# Altium schematic sheet mcu.SchDoc: Hall / Main Board / MCU and ADCs
size A4; DocumentNumber: 4; SheetNumber: 4; SheetTotal: 7
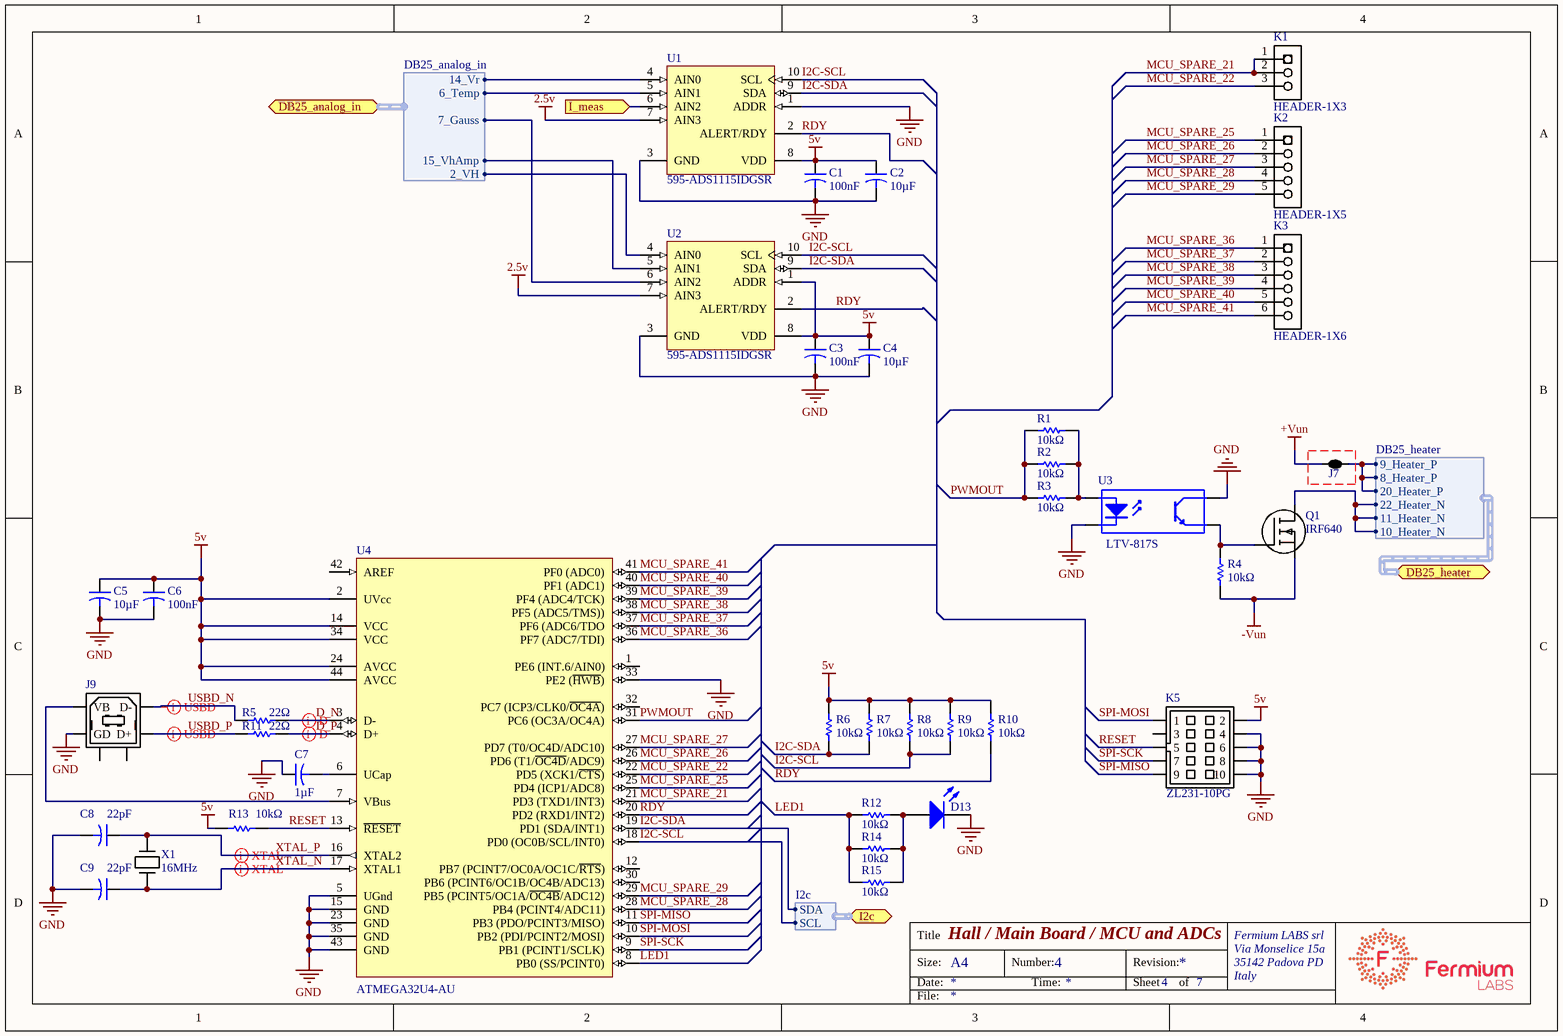
[diagram p0: mcu.SchDoc]

## Parts
C1  Capacitance: 100nF  [CAP 0805/2012]
C2  Capacitance: 10µF  [CAP 1206/3216]
C3  Capacitance: 100nF  [CAP 0805/2012]
C4  Capacitance: 10µF  [CAP 1206/3216]
C5  Capacitance: 10µF  [CAP 1206/3216]
C6  Capacitance: 100nF  [CAP 0805/2012]
C7  Capacitance: 1µF  [CAP 0805/2012]
C8  Capacitance: 22pF  [CAP 0805/2012]
C9  Capacitance: 22pF  [CAP 0805/2012]
D13  (no value)  [LED-0]
J7  2 way net tie junction  [2way_LP]  (value not drawn)  (net tie, no BOM)
J9  (no value)  [USB_TypeB]
K1  HEADER-1X3  [HEADER-1X3]  (no BOM)
K2  HEADER-1X5  [HEADER-1X5]  (no BOM)
K3  HEADER-1X6  [HEADER-1X6]  (no BOM)
K5  Supplier Part Number 1: ZL231-10PG  [IDC10-B]
Q1  IRF640  [DPAK-GDS]
R1  Resistance: 10kΩ  [RES 0805/2012]
R2  Resistance: 10kΩ  [RES 0805/2012]
R3  Resistance: 10kΩ  [RES 0805/2012]
R4  Resistance: 10kΩ  [RES 0805/2012]
R5  Resistance: 22Ω  [RES 0805/2012]
R6  Resistance: 10kΩ  [RES 0805/2012]
R7  Resistance: 10kΩ  [RES 0805/2012]
R8  Resistance: 10kΩ  [RES 0805/2012]
R9  Resistance: 10kΩ  [RES 0805/2012]
R10  Resistance: 10kΩ  [RES 0805/2012]
R11  Resistance: 22Ω  [RES 0805/2012]
R12  Resistance: 10kΩ  [RES 0805/2012]
R13  Resistance: 10kΩ  [RES 0805/2012]  (hidden comment: Res1)
R14  Resistance: 10kΩ  [RES 0805/2012]
R15  Resistance: 10kΩ  [RES 0805/2012]
U1  Supplier Part Number 1: 595-ADS1115IDGSR  [TI-DGS10_N]
U2  Supplier Part Number 1: 595-ADS1115IDGSR  [TI-DGS10_N]
U3  Supplier Part Number 1: LTV-817S  [gullwing-opto-4]  (hidden comment: LTV-817)
U4  (no value)  [44ML_N]
X1  Frequency: 16MHz  [ABRACON ABLS]

## Ports
DB25_analog_in (harness DB25_analog_in), DB25_heater (harness DB25_heater), I2c (harness I2c), I_meas (in)

## Harnesses
DB25_analog_in: 14_Vr, 15_VhAmp, 2_VH, 6_Temp, 7_Gauss
I2c: SCL, SDA
DB25_heater: 10_Heater_N, 11_Heater_N, 20_Heater_P, 22_Heater_N, 8_Heater_P, 9_Heater_P

## Nets
2.5v: U1.7(AIN3) U2.7(AIN3)
5v: C1.1 C2.1 C3.1 C4.1 C5.1 C6.1 K5.2 R6.2 R7.2 R8.2 R9.2 R10.2 R13.2 U1.8(VDD) U2.1(ADDR) U2.8(VDD) U4.2(UVcc) U4.14(VCC) U4.24(AVCC) U4.34(VCC) U4.44(AVCC)
+Vun: J7.1
-Vun: Q1.S R4.1
GND: C1.2 C2.2 C3.2 C4.2 C5.2 C6.2 C7.1 C8.2 C9.2 D13.1(K) J9.4(GD) K5.4 K5.6 K5.8 K5.10 U1.1(ADDR) U1.3(GND) U2.3(GND) U3.2(K) U3.4(C) U4.5(UGnd) U4.15(GND) U4.23(GND) U4.33(PE2_(~{HWB})) U4.35(GND) U4.43(GND)
D_N: R5.1 U4.3(D-)
D_P: R11.1 U4.4(D+)
I2C-SCL: R8.1 R9.1 U1.10(SCL) U2.10(SCL) U4.18(PD0_(OC0B/SCL/INT0)) ; port I2c.SCL
I2C-SDA: R6.1 R7.1 U1.9(SDA) U2.9(SDA) U4.19(PD1_(SDA/INT1)) ; port I2c.SDA
I_meas: U1.6(AIN2) ; port I_meas
LED1: R12.2 R14.2 R15.2 U4.8(PB0_(SS/PCINT0))
MCU_SPARE_21: K1.1 K1.2 U4.21(PD3_(TXD1/INT3))
MCU_SPARE_22: K1.3 U4.22(PD5_(XCK1/~{CTS}))
MCU_SPARE_25: K2.1 U4.25(PD4_(ICP1/ADC8))
MCU_SPARE_26: K2.2 U4.26(PD6_(T1/~{OC4D}/ADC9))
MCU_SPARE_27: K2.3 U4.27(PD7_(T0/OC4D/ADC10))
MCU_SPARE_28: K2.4 U4.28(PB4_(PCINT4/ADC11))
MCU_SPARE_29: K2.5 U4.29(PB5_(PCINT5/OC1A/~{OC4B}/ADC12))
MCU_SPARE_36: K3.1 U4.36(PF7_(ADC7/TDI))
MCU_SPARE_37: K3.2 U4.37(PF6_(ADC6/TDO)
MCU_SPARE_38: K3.3 U4.38(PF5_(ADC5/TMS)))
MCU_SPARE_39: K3.4 U4.39(PF4_(ADC4/TCK))
MCU_SPARE_40: K3.5 U4.40(PF1_(ADC1))
MCU_SPARE_41: K3.6 U4.41(PF0_(ADC0))
PWMOUT: R1.2 R2.2 R3.2 U4.31(PC6_(OC3A/OC4A))
RDY: R10.1 U1.2(ALERT/RDY) U2.2(ALERT/RDY) U4.20(PD2_(RXD1/INT2))
RESET: K5.5 R13.1 U4.13(~{RESET})
SPI-MISO: K5.9 U4.11(PB3_(PDO/PCINT3/MISO))
SPI-MOSI: K5.1 U4.10(PB2_(PDI/PCINT2/MOSI))
SPI-SCK: K5.7 U4.9(PB1_(PCINT1/SCLK))
USBD_N: J9.2(D-) R5.2
USBD_P: J9.3(D+) R11.2
XTAL_N: C9.1 U4.17(XTAL1) X1.2
XTAL_P: C8.1 U4.16(XTAL2) X1.1
NetC7_2: C7.2 U4.6(UCap)
NetD13_2: D13.2(A) R12.1 R14.1 R15.1
NetJ7_2: J7.2 ; port DB25_heater.20_Heater_P, port DB25_heater.8_Heater_P, port DB25_heater.9_Heater_P
NetJ9_1: J9.1(VB) U4.7(VBus)
NetQ1_D: Q1.D ; port DB25_heater.10_Heater_N, port DB25_heater.11_Heater_N, port DB25_heater.22_Heater_N
NetQ1_G: Q1.G R4.2 U3.3(E)
NetR1_1: R1.1 R2.1 R3.1 U3.1(A)
NetU1_4: U1.4(AIN0) ; port DB25_analog_in.14_Vr
NetU1_5: U1.5(AIN1) ; port DB25_analog_in.6_Temp
NetU2_4: U2.4(AIN0) ; port DB25_analog_in.2_VH
NetU2_5: U2.5(AIN1) ; port DB25_analog_in.15_VhAmp
NetU2_6: U2.6(AIN2) ; port DB25_analog_in.7_Gauss

Not connected (* = marked no-connect by the designer): J9 5 6; K5 3; U4 1(PE6_(INT.6/AIN0)) 12(PB7_(PCINT7/OC0A/OC1C/~{RTS})) 30(PB6_(PCINT6/OC1B/OC4B/ADC13)) 32(PC7_(ICP3/CLK0/~{OC4A})) 42(AREF)

## Layout directives
differential pair: D_N, D_P, USBD_N, USBD_P, XTAL_N, XTAL_P

## Notes on the sheet
- Title
- Size:
- Date:
- A4
- Number:
- Time:
- Revision:
- Sheet
- of
- Fermium LABS srl
- Via Monselice 15a
- 35142 Padova PD
- Italy
- File:

## Library data of the parts
C1 C3 C6 = Cap2: Capacitor; Manufacturer: YAGEO; Manufacturer Part Number: CC0805JRX7R9BB104; Unit: pcs; SuppliedAmount: 0; MinAmount: 100; Capacitor type: ceramic; Capacitor kind: MLCC; Operating voltage: 50V; Dielectric: X7R; Tolerance: ±5%; Case - inch: 0805; Case - mm: 2012; Pads: 2 SMD; Supplier 1: TME; Supplier Part Number 1: CC0805JRX7R9104; Category: 0805 MLCC SMD Capacitors; Stock 1: 89911; Pricing 1: 100=0.00613, 300=0.00464, 1000=0.00342, 4000=0.00284, 20000=0.00273 (EUR); Weight: 0.042; Multiples: 100; Mounting: SMD; Price Type: NET; ComponentLink1URL: http://static.tme.eu/products_pics/d/b/b/dbbd93eaf25225110ca26eb66da77328/58538.jpg; ComponentLink1Description: http://static.tme.eu/products_pics/d/b/b/dbbd93eaf25225110ca26eb66da77328/58538.jpg
C2 C4 C5 = Cap2: Capacitor; Manufacturer: SAMSUNG; Manufacturer Part Number: CL31A106KAHNNNE; Unit: pcs; SuppliedAmount: 0; MinAmount: 100; Capacitor type: ceramic; Capacitor kind: MLCC; Operating voltage: 25V; Dielectric: X5R; Tolerance: ±10%; Case - inch: 1206; Case - mm: 3216; Pads: 2 SMD; Published: 23-Sep-2002; PackageReference: CAPR5-4X5; Publisher: Altium Limited; PackageDescription: 1206; Supplier 1: TME; Supplier Part Number 1: CL31A106KAHNNNE; Category: 1206 MLCC SMD Capacitors; Stock 1: 279700; Pricing 1: 100=0.0248, 300=0.0203, 1000=0.0167, 2000=0.0131, 10000=0.0127 (EUR); Weight: 0.061; Multiples: 100; Mounting: SMD; Operating temperature: -55...85°C; Price Type: NET; ComponentLink1URL: http://static.tme.eu/products_pics/b/e/9/be9e0dd298dcf4979ea1dd3d226e0bfa/58780.jpg; ComponentLink1Description: http://static.tme.eu/products_pics/b/e/9/be9e0dd298dcf4979ea1dd3d226e0bfa/58780.jpg
C7 = Cap2: Capacitor; Manufacturer: SAMSUNG; Manufacturer Part Number: CL21B105KAFNNNE; Unit: pcs; SuppliedAmount: 0; MinAmount: 100; Capacitor type: ceramic; Capacitor kind: MLCC; Operating voltage: 25V; Dielectric: X7R; Tolerance: ±10%; Case - inch: 0805; Case - mm: 2012; Pads: 2 SMD; Published: 23-Sep-2002; PackageReference: CAPR5-4X5; Publisher: Altium Limited; PackageDescription: Capacitor; 2 Leads; Supplier 1: TME; Supplier Part Number 1: CL21B105KAFNNNE; Category: 0805 MLCC SMD Capacitors; Stock 1: 56790; Pricing 1: 100=0.0108, 300=0.00924, 1000=0.00748, 2000=0.006, 6000=0.0058 (EUR); Weight: 0.039; Multiples: 100; Mounting: SMD; Operating temperature: -55...125°C; Price Type: NET; ComponentLink1URL: http://static.tme.eu/products_pics/d/b/b/dbbd93eaf25225110ca26eb66da77328/58538.jpg; ComponentLink1Description: http://static.tme.eu/products_pics/d/b/b/dbbd93eaf25225110ca26eb66da77328/58538.jpg
C8 C9 = Cap2: Capacitor; Manufacturer: SAMSUNG; Manufacturer Part Number: CL21C220JBANNNC; Unit: pcs; SuppliedAmount: 0; MinAmount: 100; Capacitor type: ceramic; Capacitor kind: MLCC; Operating voltage: 50V; Dielectric: C0G; Tolerance: ±5%; Case - inch: 0805; Case - mm: 2012; Pads: 2 SMD; Published: 23-Sep-2002; PackageReference: CAPR5-4X5; Publisher: Altium Limited; PackageDescription: Capacitor; 2 Leads; Supplier 1: TME; Supplier Part Number 1: CL21C220JBANNNC; Category: 0805 MLCC SMD Capacitors; Stock 1: 298580; Pricing 1: 100=0.00603, 300=0.00435, 1000=0.00317, 4000=0.00171, 12000=0.00163 (EUR); Weight: 0.032; Multiples: 100; Mounting: SMD; Operating temperature: -55...125°C; Price Type: NET; ComponentLink1URL: http://static.tme.eu/products_pics/d/b/b/dbbd93eaf25225110ca26eb66da77328/58538.jpg; ComponentLink1Description: http://static.tme.eu/products_pics/d/b/b/dbbd93eaf25225110ca26eb66da77328/58538.jpg
D13 = LED0: LED red 5mm; Manufacturer: KINGBRIGHT ELECTRONIC; Manufacturer Part Number: L-1503CB/1ID; Unit: pcs; SuppliedAmount: 0; MinAmount: 5; Multiples: 1; LED version: in housing; Front: convex; LED lens: diffused; LED current: 20mA; Viewing angle: 60°; Operating voltage: 2...2.5V; Luminosity: 8-30mcd; Wavelength: 625nm; Pads: 2 THT; Supplier 1: TME; Supplier Part Number 1: L-1503CB/1ID; Category: LED Circuit Board Indicators; Stock 1: 1055; Pricing 1: 5=0.1308, 10=0.11837, 25=0.10529, 100=0.09483, 500=0.08829 (EUR); Weight: 0.4; Diode type: LED; LED colour: red; Mounting: THT; LED diameter: 5mm; Number of diodes: 1; Price Type: NET; ComponentLink1URL: http://static.tme.eu/products_pics/2/d/8/2d8734f7e5dfd4453dcfb445f87d0bf6/363629.jpg; ComponentLink1Description: http://static.tme.eu/products_pics/2/d/8/2d8734f7e5dfd4453dcfb445f87d0bf6/363629.jpg
J7 = 2way: ComponentLink1URL: http://www.edatools.cz/addons; ComponentLink1Description: Source; FootprintNote: LP=12mil, MP=40mil, HP=120mil
J9 = USB-B: USB b device connector; Manufacturer: LUMBERG; Manufacturer Part Number: 2411 02; Unit: pcs; SuppliedAmount: 0; MinAmount: 1; Connector: socket; Connector type: USB B; Mechanical mounting: on PCBs; Electrical mounting: THT; Spatial orientation: angled 90°; Variant: USB 2.0; Pads: 6 THT; Supplier 1: TME; Supplier Part Number 1: 2411-02; Category: USB & IEEE1394 connectors; Stock 1: 1211; Pricing 1: 1=0.58, 10=0.52, 50=0.46, 100=0.4 (EUR); Weight: 3.4; Multiples: 1; Number of pins: 4; Colour: white; Price Type: NET; ComponentLink1URL: http://static.tme.eu/products_pics/d/8/1/d81dedeb5f01696a6050c2c1b3ea9f71/397242.jpg; ComponentLink1Description: http://static.tme.eu/products_pics/d/8/1/d81dedeb5f01696a6050c2c1b3ea9f71/397242.jpg
K2 = HEADER-1X5: PINHEADER 1X5; REEL: TH; Supplier 1: Digi-Key; Supplier Part Number 1: S1011E-36-ND
K5 = IDC10: header 10pin, boxed; Manufacturer: NINIGI; Unit: pcs; SuppliedAmount: 0; MinAmount: 10; Connector: socket; Connector type: IDC; Spatial orientation: straight; Electrical mounting: THT; Contacts pitch: 2.54mm; Type of pin configuration: 2x5; Pads: 10 THT; Supplier 1: TME; Manufacturer Part Number: ZL231-10PG; Category: IDC connectors; Stock 1: 106380; Pricing 1: 10=0.08292, 50=0.07256, 200=0.06219, 1000=0.05183, 5000=0.04147 (EUR); Weight: 1.433; Multiples: 10; Number of pins: 10; Contact plating: gold plated; Price Type: NET; ComponentLink1URL: http://static.tme.eu/products_pics/2/9/e/29e35db67837c6e13659dd28b2765932/375255.jpg; ComponentLink1Description: http://static.tme.eu/products_pics/2/9/e/29e35db67837c6e13659dd28b2765932/375255.jpg
Q1 = IRLML2502: N CHANNEL MOSFET; Manufacturer Part Number: IRF640NSPBF; Pads: 3 SMD; Supplier 1: TME; Supplier Part Number 1: IRF640NSPBF
R1-R4 R6-R10 R12-R15 = Res1: Resistor; Manufacturer: YAGEO; Manufacturer Part Number: RC0805JR-0710KL; Unit: pcs; SuppliedAmount: 0; MinAmount: 100; Case - inch: 0805; Case - mm: 2012; Power: 0.125W; Tolerance: ±5%; Max. operating voltage: 150V; Max. overload voltage: 300V; Pads: 2 SMD; Published: 8-Jun-2000; LatestRevisionDate: 17-Jul-2002; LatestRevisionNote: Re-released for DXP Platform.; PackageReference: AXIAL-0.3; Publisher: Altium Limited; PackageDescription: Axial Device, Thru-Hole; 2 Leads; 0.3 in Pin Spacing; Supplier 1: TME; Supplier Part Number 1: RC0805JR-0710K; Category: 0805 SMD Resistors; Stock 1: 121900; Pricing 1: 100=0.006, 1000=0.0036, 5000=0.00118, 15000=0.00108, 50000=0.00094 (EUR); Weight: 0.028; Multiples: 100; Resistor type: thick film; Mounting: SMD; Operating temperature: -55...155°C; Price Type: NET; ComponentLink1URL: http://static.tme.eu/products_pics/6/6/c/66cc5cd64257edd80ca8e9fd2040972d/56038.jpg; ComponentLink1Description: http://static.tme.eu/products_pics/6/6/c/66cc5cd64257edd80ca8e9fd2040972d/56038.jpg
R5 R11 = Res1: Resistor; Manufacturer: ROYAL OHM; Manufacturer Part Number: 0805S8F220JT5E; Unit: pcs; SuppliedAmount: 0; MinAmount: 100; Case - inch: 0805; Case - mm: 2012; Power: 0.125W; Tolerance: ±1%; Max. operating voltage: 150V; Max. overload voltage: 300V; Temperature coefficient: 200ppm/°C; Pads: 2 SMD; Supplier 1: TME; Supplier Part Number 1: SMD0805-22R-1%; Category: 0805 SMD Resistors; Stock 1: 22000; Pricing 1: 100=0.00846, 1000=0.00329, 5000=0.00113, 15000=0.00108, 50000=0.00103 (EUR); Weight: 0.031; Multiples: 100; Resistor type: thick film; Mounting: SMD; Operating temperature: -55...125°C; Price Type: NET; ComponentLink1URL: http://static.tme.eu/products_pics/a/3/4/a34f7a182e69d69fdfdb65c44b99ca64/60560.jpg; ComponentLink1Description: http://static.tme.eu/products_pics/a/3/4/a34f7a182e69d69fdfdb65c44b99ca64/60560.jpg
U1 U2 = ADS1115IDGSR: 16-Bit 4 channel ADC with PGA and reference; Manufacturer: Texas Instruments; Input Type: Differential/Single-Ended; Number of Converters: 1 Converter; Resolution: 16 bit; Sampling Rate: 860 S/s; Architecture: Sigma-Delta; Interface Type: Serial, 2-Wire, I2C; Number of Channels: 2 Channel/4 Channel; Reference Type: Internal; Analog Supply Voltage: 2 V to 5.5 V; INL - Integral Nonlinearity: 1 LSB; Pd - Power Dissipation: 900 uW; Pads: 8 SMD; Supplier 1: Mouser; Manufacturer Part Number: ADS1115IDGSR; RoHS: RoHS Compliant; Category: Analog to Digital Converters - ADC; Stock 1: 6215; Pricing 1: 1=4.96, 10=4.45, 25=4.15, 50=3.93, 100=3.65, 250=3.47, 500=3.10, 1000=2.43, 2500=2.43 (EUR); Features: PGA, Oscillator, Internal Reference, Comparator; Height: 1.02 mm; Length: 3 mm; Package / Case: VSSOP-10; Packaging: Reel; Product: Analog to Digital Converters; Series: ADS1115; Type: Precision ADC; Width: 3 mm; Brand: Texas Instruments; Mounting Style: SMD/SMT; Shutdown: Shutdown; Digital Supply Voltage: 2 V to 5.5 V; Maximum Operating Temperature: + 125 C; Minimum Operating Temperature: - 40 C; Operating Supply Voltage: 2 V to 5.5 V; Standard Pack Qty: 2500; RoHS - Mouser: Y; Minimum Order Quantity: 1; Reeling: True
U3 = Optoisolator1: 4-Pin Phototransistor Optocoupler; Manufacturer: LITEON; Unit: pcs; SuppliedAmount: 0; MinAmount: 5; Multiples: 1; Insulation voltage: 5kV; CTR@If: 50-600%@5mA; Collector-emitter voltage: 35V; Pads: 4 SMD; Published: 24-Mar-1999; LatestRevisionDate: 04-Mar-2005; LatestRevisionNote: Sch pins 3 & 4 Swapped.; DatasheetVersion: Nov-2003; PackageReference: DIP-4; Publisher: Altium Limited; Supplier 1: TME; Manufacturer Part Number: LTV-817S; Category: Optocouplers - Analog Output; Stock 1: 45338; Pricing 1: 5=0.0986, 10=0.0883, 25=0.0813, 250=0.0715 (EUR); Weight: 0.211; Type of semiconductor component: optocoupler; Mounting: SMD; Number of channels: 1; Output type: transistor; Case: Gull wing 4; Price Type: NET; ComponentLink1URL: http://static.tme.eu/products_pics/6/f/5/6f53ad03154050309bf911a8cef2b774/437233.jpg; ComponentLink1Description: http://static.tme.eu/products_pics/6/f/5/6f53ad03154050309bf911a8cef2b774/437233.jpg
U4 = ATmega32U4-AU: 8-bit AVR MCU, 16MHz, 32KB Flash, 1KB EEPROM, 2.5KB SRAM, USB; Manufacturer: ATMEL; Integrated circuit type: AVR microcontroller; Pads: 42 SMD; Supplier 1: TME; Supplier Part Number 1: ATMEGA32U4-AU; Manufacturer Part Number: ATMEGA32U4-AU; Case: TQFP44; Mounting: SMD
X1 = CRYSTAL-GENERIC: quartz crystal; Manufacturer: YIC; Unit: pcs; SuppliedAmount: 0; MinAmount: 2; Multiples: 1; Resonator tolerance: ±30ppm; Capacitance: 20pF; Power: 1mW; Time stability: ±5ppm/year; Pads: 2 SMD; Supplier 1: TME; Supplier Part Number 1: 16.00M-SMDHC49S; Category: SMD Quartz Crystals; Stock 1: 11958; Pricing 1: 2=0.3697, 10=0.2143, 100=0.1318, 1000=0.1033, 4000=0.0995 (EUR); Weight: 1.11; Resonator type: quartz; Mounting: SMD; Case: HC49SM; Price Type: NET; ComponentLink1URL: http://static.tme.eu/products_pics/0/4/3/0433aed25ec1f9097194a826a55aa53d/56913.jpg; ComponentLink1Description: http://static.tme.eu/products_pics/0/4/3/0433aed25ec1f9097194a826a55aa53d/56913.jpg
K1 = HEADER-1X3: Supplier 1: Digi-Key; Supplier Part Number 1: S1011E-36-ND
K3 = HEADER-1X6: Supplier 1: Digi-Key; Supplier Part Number 1: S1011E-36-ND